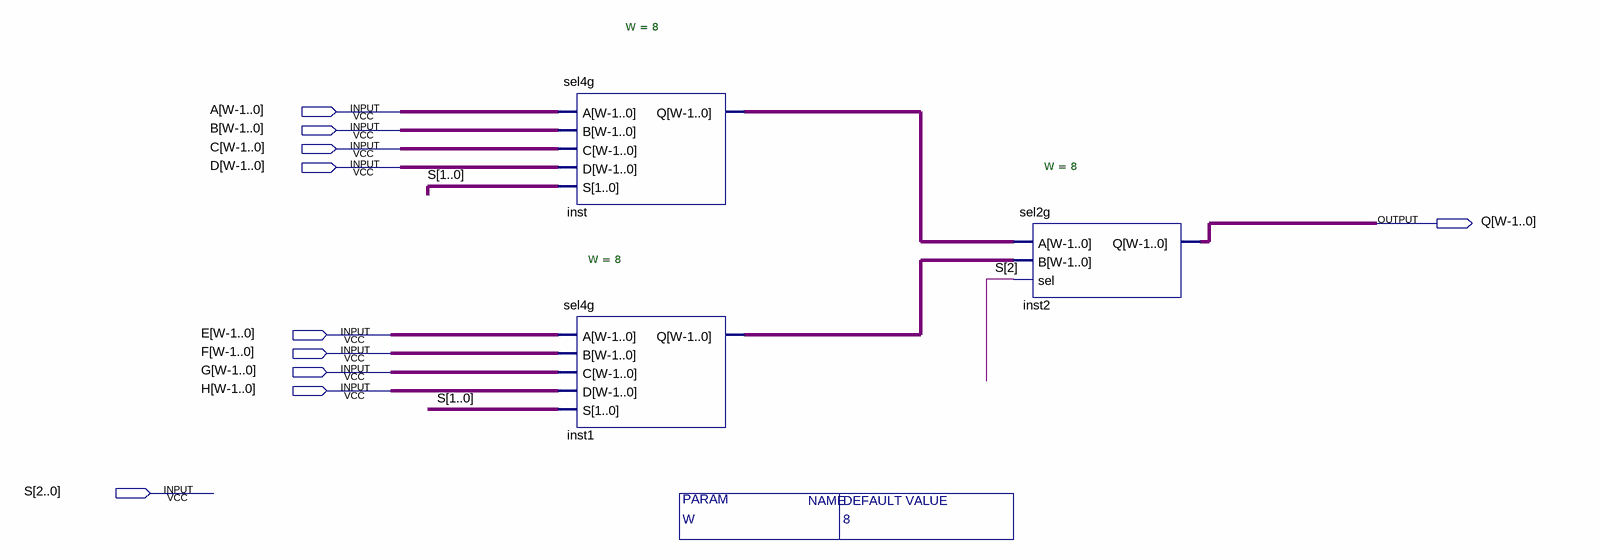
[diagram p0: schematic sheet]
// Quartus schematic sel8g.bdf as structural Verilog: 3 symbols, 10 pins
module sel8g #(parameter W = 8) (
  input  [7:0] A,
  input  [7:0] B,
  input  [7:0] C,
  input  [7:0] D,
  input  [7:0] E,
  input  [7:0] F,
  input  [7:0] G,
  input  [7:0] H,
  input  [2:0] S,
  output [7:0] Q
);

  wire [7:0] inst1_q, inst_q;

  sel4g #(.W(8)) inst (.A(A), .B(B), .C(C), .D(D), .S(S[1:0]), .Q(inst_q));
  sel4g #(.W(8)) inst1 (.A(E), .B(F), .C(G), .D(H), .S(S[1:0]), .Q(inst1_q));
  sel2g #(.W(8)) inst2 (.A(inst_q), .B(inst1_q), .sel(S[2]), .Q(Q));
endmodule
